# Altium schematic sheet FLASH.SchDoc: Наименование
size 209 x 297 mm; ApprovedBy: Утвердил; CheckedBy: Проверил; Author: Разработал; CompanyName: Организация; DrawnBy: Н.Контр; Engineer: Т.Контр; SheetNumber: 1; SheetTotal: 1; PageSetup: Record=PageOptions|CenterHorizontal=True|CenterVertical=True|PrintScale=0.94|XCorrection=1.00|YCorrection=1.00|PrintKind=1|BorderSize=5000000|LeftOffset=0|BottomOffset=0|Orientation=1|PaperLength=1000|PaperWidth=1000|Scale=100|PaperSource=7|PrintQuality=-4|MediaType=1|DitherType=10|PaperKind=A4|PrintScaleMode=1; DecimalNumber: FLASH; HeadOfSector: Нач. сектора; MainDevice: Перв.примен.; Name: Наименование; DocumentName: Sheet1.SCHDOC
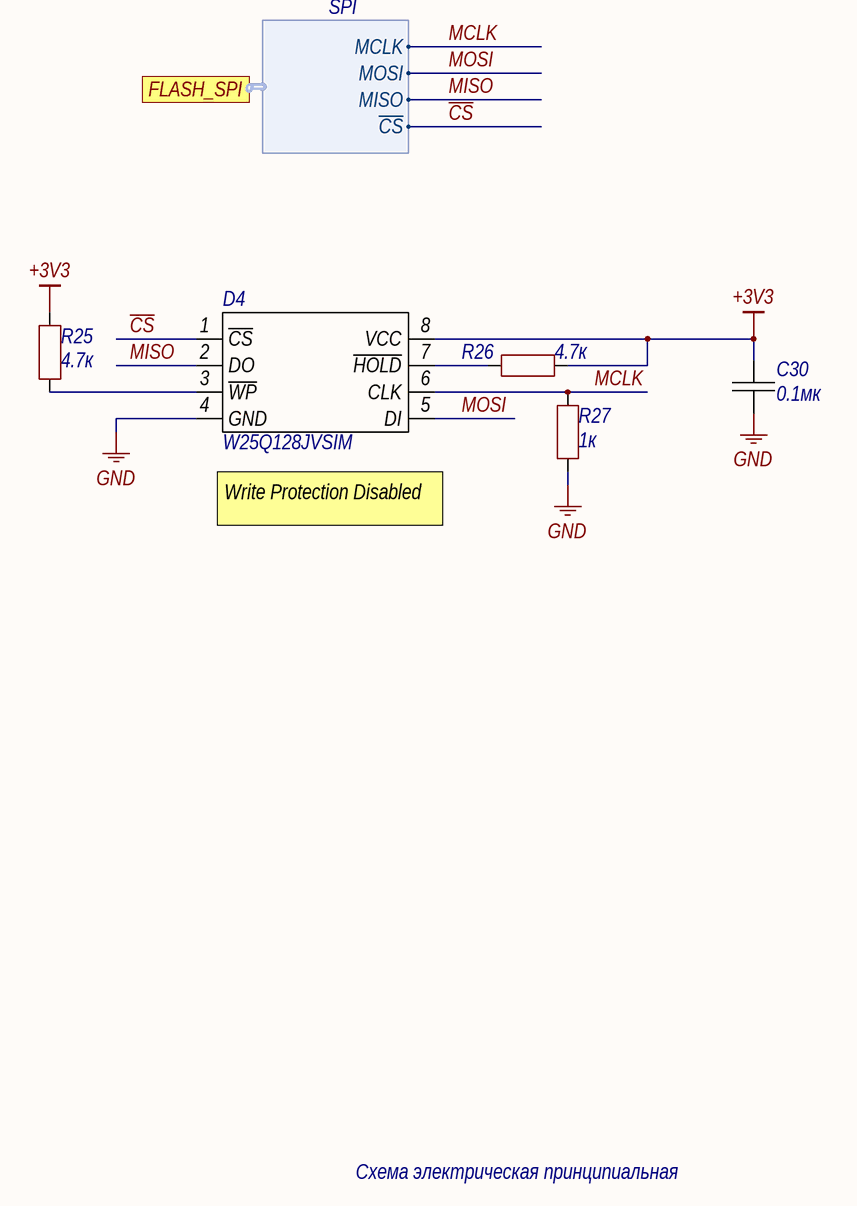
[diagram p0: FLASH.SchDoc]

## Parts
C30  value 0.1мк  [CAP0402]  (hidden comment: 0.1мк 50V)
D4  MPN: W25Q128JVSIM  [SOIC-8_208MIL_M]
R25  value 4.7к  [RESC0402(1005)_M]  (hidden comment: 4.7к 1/16W)
R26  value 4.7к  [RESC0402(1005)_M]  (hidden comment: 4.7к 1/16W)
R27  value 1к  [RESC0402(1005)_M]  (hidden comment: 1к 1/16W)

## Ports
FLASH_SPI (harness SPI)

## Harnesses
SPI: MCLK, MOSI, MISO, ~{CS}

## Nets
+3V3: C30.2 D4.8(VCC) R25.1 R26.1
GND: C30.1 D4.4(GND) R27.1
~{CS}: D4.1(~{CS}) ; port FLASH_SPI.~{CS}
MCLK: D4.6(CLK) R27.2 ; port FLASH_SPI.MCLK
MISO: D4.2(DO) ; port FLASH_SPI.MISO
MOSI: D4.5(DI) ; port FLASH_SPI.MOSI
NetD4_3: D4.3(~{WP}) R25.2
NetD4_7: D4.7(~{HOLD}) R26.2

## Notes on the sheet
- (near D4) Write Protection Disabled
- Схема электрическая принципиальная
- Подп. и дата
- Инв.№ дубл.
- Взам.инв.№
- Подп.и дата
- Инв.№ подл.
- Изм.
- Лист
- № докум.
- Подп.
- Дата
- Формат  A4

## Library data of the parts
C30 = CAP0402: Manufacturer: Samsung Electro-Mechanics; ManufacturerAlt: JLCPCB; MPN: CL05B104KB54PNC; MPNAlt: C307331; MntType: SMD; Notes: Basic Part; Tolerance: 10%; Height: 0.5mm; MSL: MSL 1; Package: =Footprint; RoHS: Comply; Weight: 1.500mg; PartType: CHIP CERAMIC CAPACITOR; Pins: 2; BOMDescription: =MntType+' '+PartType+' '+Package+' '+Value+' '+Tolerance+' '+Voltage+' '+TempCoeff+' '+MPN; CFootprint: =Footprint; Voltage: 50V; Part Number: CAP0402; ClassName: Capacitor; ComponentLink1Description: Datasheet; ComponentLink1Description: New link; ComponentLink1URL: https://datasheet.lcsc.com/lcsc/1810191222_Samsung-Electro-Mechanics-CL05B104KB54PNC_C307331.pdf
D4 = W25Q128JVSIM: Manufacturer: WINBOND; MntType: SMD; Part Number: W25Q128JVSIM; MSL: MSL 1; Package: SO-8; RoHS: Comply; PartType: Flash; Pins: 8; BOMDescription: W25Q128JVSIM; CFootprint: =Footprint; ClassName: Flash; ComponentLink1Description: Datasheet; ComponentLink1URL: https://www.winbond.com/resource-files/w25q128jv_dtr%20revc%2003272018%20plus.pdf
R25 R26 = RES0402: Manufacturer: UNI-ROYAL; ManufacturerAlt: JLCPCB; MPN: 0402WGF4701TCE; MPNAlt: C25900; MntType: SMD; Notes: Basic Part; TempCoeff: 100ppm/C; Tolerance: 1%; Voltage: 50V; Height: 0.35mm; MSL: MSL 1; Package: =Footprint; Power: 1/16W; RoHS: Comply; PartType: CHIP RESISTOR; Pins: 2; BOMDescription: =MntType+' '+PartType+' '+Package+' '+Value+' '+Tolerance+' '+Voltage+' '+TempCoeff+' '+MPN; CFootprint: =Footprint; Part Number: RES0402; ClassName: Resistor; ComponentLink1Description: Datasheet; ComponentLink1Description: New link; ComponentLink1URL: https://datasheet.lcsc.com/lcsc/1810301132_UNI-ROYAL-Uniroyal-Elec-0402WGF4701TCE_C25900.pdf
R27 = RES0402: Manufacturer: UNI-ROYAL; ManufacturerAlt: JLCPCB; MPN: 0402WGF1001TCE; MPNAlt: C11702; MntType: SMD; TempCoeff: 100ppm/C; Tolerance: 1%; Voltage: 50V; Height: 0.35mm; MSL: MSL 1; Package: =Footprint; Power: 1/16W; RoHS: Comply; PartType: CHIP RESISTOR; Pins: 2; BOMDescription: =MntType+' '+PartType+' '+Package+' '+Value+' '+Tolerance+' '+Voltage+' '+TempCoeff+' '+MPN; CFootprint: =Footprint; Part Number: RES0402; ClassName: Resistor; ComponentLink1Description: Datasheet; ComponentLink1Description: New link; ComponentLink1URL: https://datasheet.lcsc.com/lcsc/1811132311_UNI-ROYAL-Uniroyal-Elec-0402WGF1001TCE_C11702.pdf